# Altium schematic sheet Relay.SchDoc
size A; SheetNumber: 4; SheetTotal: 8
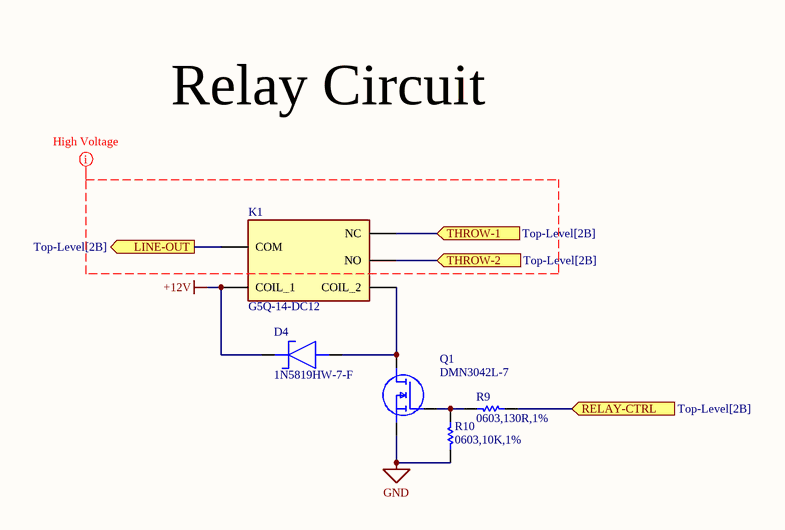
[diagram p0: Relay.SchDoc]

## Parts
D4  1N5819HW-7-F  [SOD3716X145N]
K1  G5Q-14-DC12  [G5Q14DC12]
Q1  DMN3042L-7  [SOT96P240X115-3N]
R9  0603,130R,1%  [RESC1608X55N]
R10  0603,10K,1%  [RESC1608X55N]

## Ports
LINE-OUT (out, see Top-Level[2B]), RELAY-CTRL (in, see Top-Level[2B]), THROW-1 (in, see Top-Level[2B]), THROW-2 (in, see Top-Level[2B])

## Nets
+12V: D4.1(K) K1.1(COIL_1)
GND: Q1.2(S) R10.1
LINE-OUT: K1.2(COM) ; port LINE-OUT
RELAY-CTRL: R9.1 ; port RELAY-CTRL
THROW-1: K1.4(NC) ; port THROW-1
THROW-2: K1.3(NO) ; port THROW-2
NetD4_2: D4.2(A) K1.5(COIL_2) Q1.3(D)
NetQ1_1: Q1.1(G) R9.2 R10.2

## Layout directives
net class High-Voltage: (no net found under the mark)

## Notes on the sheet
- Relay Circuit

## Library data of the parts
D4 = 1N5819HW-7-F: 40V 450mV@1A 1A SOD-123 Schottky Diodes ROHS; Manufacturer_Name: Diodes Incorporated; Datasheet Link: https://www.diodes.com//assets/Datasheets/1N5819HW.pdf; Height: 1.45mm; Manufacturer_Part_Number: 1N5819HW-7-F; Mouser Part Number: 621-1N5819HW-F; Mouser Price/Stock: https://www.mouser.co.uk/ProductDetail/Diodes-Incorporated/1N5819HW-7-F?qs=NQ47qNm99eDyWTEd07miYA%3D%3D; Arrow Part Number: 1N5819HW-7-F; Arrow Price/Stock: https://www.arrow.com/en/products/1n5819hw-7-f/diodes-incorporated?utm_currency=USD&region=nac; LCSC Part Number: C82544
K1 = G5Q-14-DC12: 12V 10A 1 Form C: 1C (SPDT-CO) Through Hole,10x20mm Power Relays ROHS; Manufacturer_Name: Omron Electronics; Datasheet Link: https://datasheet.lcsc.com/szlcsc/Omron-Electronics-G5Q-14-DC12_C225715.pdf; Height: 16.2mm; Manufacturer_Part_Number: G5Q-14-DC12; Mouser Part Number: 653-G5Q-14-DC12; Mouser Price/Stock: https://www.mouser.co.uk/ProductDetail/Omron-Electronics/G5Q-14-DC12?qs=lK7M36XCk6KX8SEFaHI6UQ%3D%3D; Arrow Part Number: G5Q-14-DC12; Arrow Price/Stock: https://www.arrow.com/en/products/g5q-14-dc12/omron?utm_currency=USD&region=nac; LCSC Part Number: C225715
Q1 = DMN3042L-7: N-Channel 30 V 5.8A (Ta) 720mW (Ta) Surface Mount SOT-23-3; Manufacturer_Name: Diodes Incorporated; Datasheet Link: https://www.diodes.com//assets/Datasheets/DMN3042L.pdf; Height: 1.15mm; Manufacturer_Part_Number: DMN3042L-7; Mouser Part Number: 621-DMN3042L-7; Mouser Price/Stock: https://www.mouser.co.uk/ProductDetail/Diodes-Incorporated/DMN3042L-7?qs=BvpHGKeVh3rQK2Uscu7jEw%3D%3D; Arrow Part Number: DMN3042L-7; Arrow Price/Stock: https://www.arrow.com/en/products/dmn3042l-7/diodes-incorporated?utm_currency=USD&region=nac; LCSC Part Number: C2838502
R9 = RC0603FR-07130RL: 130 Ohms ±1% 0.1W, 1/10W Chip Resistor 0603 (1608 Metric) Moisture Resistant Thick Film; Manufacturer_Name: YAGEO; Datasheet Link: https://www.mouser.com/catalog/specsheets/YAGEO_PYu_RC_Group_51_RoHS_L_12.pdf; Height: 0.55mm; Manufacturer_Part_Number: RC0603FR-07130RL; LCSC Part Number: C141677
R10 = RC0603FR-0710KL: 100mW Thick Film Resistor 75V ±100ppm/℃ ±1% 10kΩ 0603 Chip Resistor - Surface Mount ROHS; Manufacturer_Name: YAGEO; Datasheet Link: https://www.mouser.in/datasheet/2/447/PYu_RC_Group_51_RoHS_L_11-1984063.pdf; Height: 0.55mm; Manufacturer_Part_Number: RC0603FR-0710KL; Mouser Part Number: 603-RC0603FR-0710KL; Mouser Price/Stock: https://www.mouser.co.uk/ProductDetail/YAGEO/RC0603FR-0710KL?qs=grNVn54RoB%252B3GtjbJj3wJQ%3D%3D; Arrow Part Number: RC0603FR-0710KL; Arrow Price/Stock: https://www.arrow.com/en/products/rc0603fr-0710kl/yageo?utm_currency=USD&region=nac; LCSC Part Number: C98220